# Altium project PCB_Project.PrjPcb
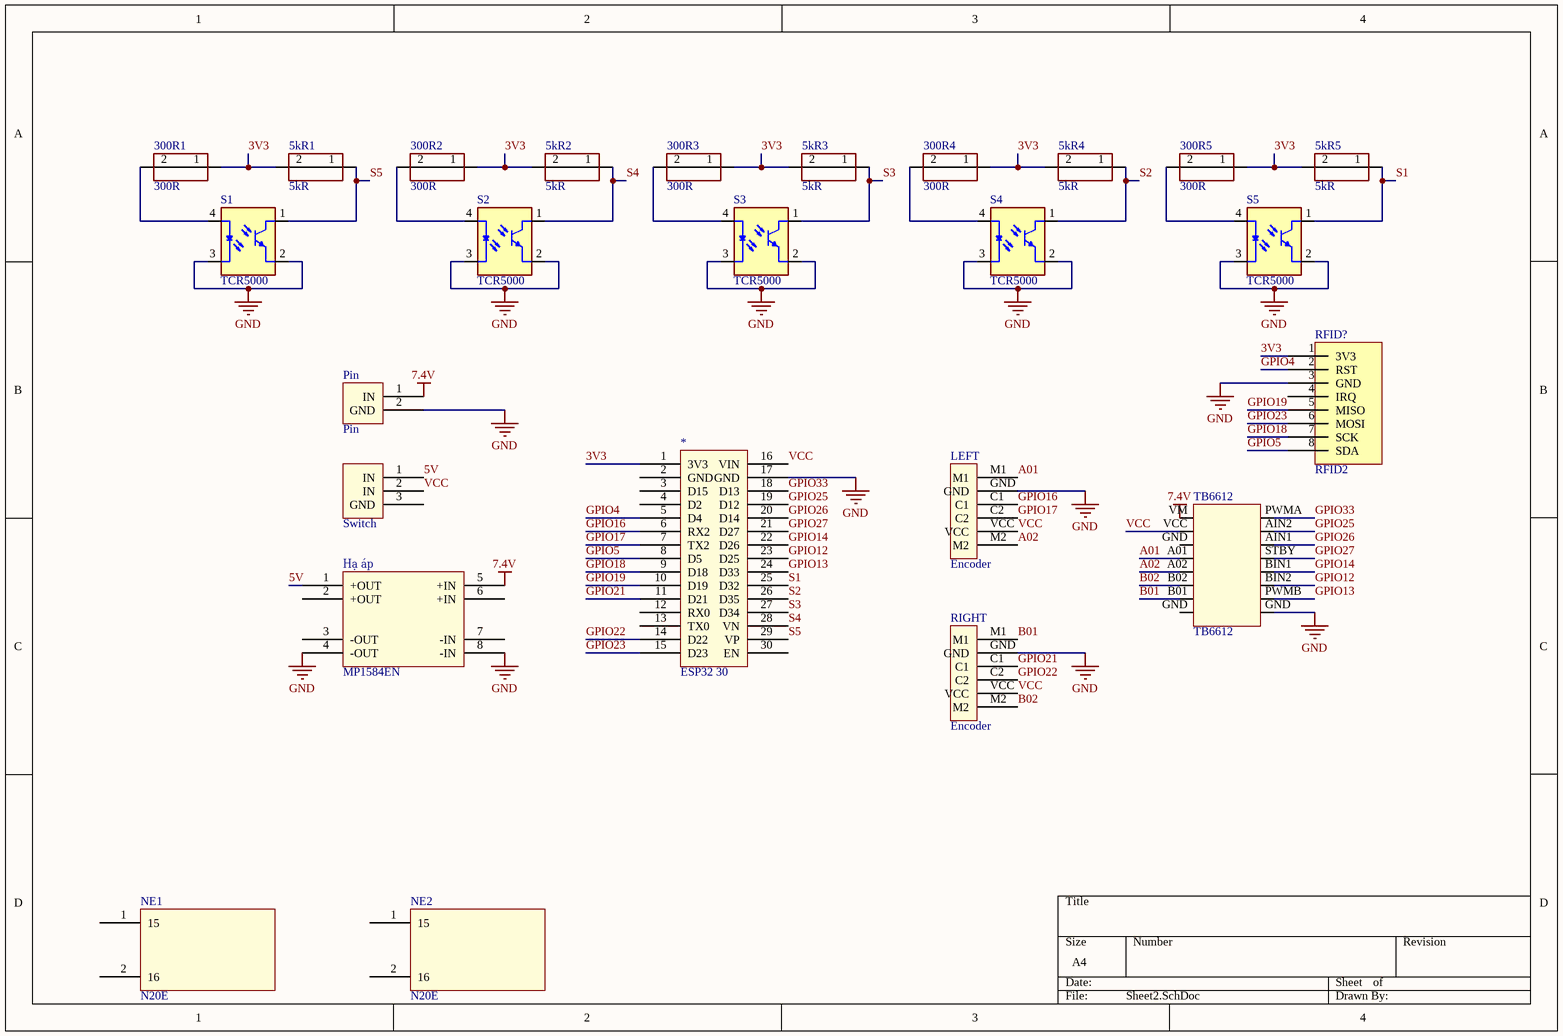
[diagram p0: Sheet2.SchDoc]
1 sheet, 25 parts. Net scope: global (net labels, ports and power ports of the same name join across sheets).
Board file: PCB3.PcbDoc

## Sheet Sheet2.SchDoc
size A4; SheetNumber: 1; SheetTotal: 1

### Parts
5kR1  5kR  [CMD]
5kR2  5kR  [CMD]
5kR3  5kR  [CMD]
5kR4  5kR  [CMD]
5kR5  5kR  [CMD]
300R1  300R  [CMD]
300R2  300R  [CMD]
300R3  300R  [CMD]
300R4  300R  [CMD]
300R5  300R  [CMD]
*  ESP32 30  [ESP32 30]
?  Switch  [Switch]
Hạ_áp  MP1584EN  [MP1584EN]
LEFT  Encoder  [Encoder]
NE1  N20E  [N20E]
NE2  N20E  [N20E]
Pin  Pin  [Pin]
RFID?  RFID2  [header_femalex8]
RIGHT  Encoder  [Encoder]
S1  TCR5000  [TCR5000]
S2  TCR5000  [TCR5000]
S3  TCR5000  [TCR5000]
S4  TCR5000  [TCR5000]
S5  TCR5000  [TCR5000]
TB6612  TB6612  [TB6612]

### Nets
7.4V: Hạ_áp.5(+IN) Pin.1(IN) TB6612.VM
GND: *.17(GND) Hạ_áp.4(-OUT) Hạ_áp.8(-IN) LEFT.GND Pin.2(GND) RFID?.3(GND) RIGHT.GND S1.2(E) S1.3(C) S2.2(E) S2.3(C) S3.2(E) S3.3(C) S4.2(E) S4.3(C) S5.2(E) S5.3(C) TB6612.GND
3V3: 5kR1.2 5kR2.2 5kR3.2 5kR4.2 5kR5.2 300R1.1 300R2.1 300R3.1 300R4.1 300R5.1 *.1(3V3) RFID?.1(3V3)
5V: ?.1(IN) Hạ_áp.1(+OUT)
A01: LEFT.M1 TB6612.A01
A02: LEFT.M2 TB6612.A02
B01: RIGHT.M1 TB6612.B01
B02: RIGHT.M2 TB6612.B02
GPIO4: *.5(D4) RFID?.2(RST)
GPIO5: *.8(D5) RFID?.8(SDA)
GPIO12: *.23(D25) TB6612.BIN2
GPIO13: *.24(D33) TB6612.PWMB
GPIO14: *.22(D26) TB6612.BIN1
GPIO16: *.6(RX2) LEFT.C1
GPIO17: *.7(TX2) LEFT.C2
GPIO18: *.9(D18) RFID?.7(SCK)
GPIO19: *.10(D19) RFID?.5(MISO)
GPIO21: *.11(D21) RIGHT.C1
GPIO22: *.14(D22) RIGHT.C2
GPIO23: *.15(D23) RFID?.6(MOSI)
GPIO25: *.19(D12) TB6612.AIN2
GPIO26: *.20(D14) TB6612.AIN1
GPIO27: *.21(D27) TB6612.STBY
GPIO33: *.18(D13) TB6612.PWMA
S1: 5kR5.1 *.25(D32) S5.1(CO)
S2: 5kR4.1 *.26(D35) S4.1(CO)
S3: 5kR3.1 *.27(D34) S3.1(CO)
S4: 5kR2.1 *.28(VN) S2.1(CO)
S5: 5kR1.1 *.29(VP) S1.1(CO)
VCC: *.16(VIN) ?.2(IN) LEFT.VCC RIGHT.VCC TB6612.VCC
Net300R1_2: 300R1.2 S1.4(A)
Net300R2_2: 300R2.2 S2.4(A)
Net300R3_2: 300R3.2 S3.4(A)
Net300R4_2: 300R4.2 S4.4(A)
Net300R5_2: 300R5.2 S5.4(A)

Not connected (* = marked no-connect by the designer): * 2(GND) 3(D15) 4(D2) 12(RX0) 13(TX0) 30(EN); ? 3(GND); Hạ_áp 2(+OUT) 3(-OUT) 6(+IN) 7(-IN); NE1 1(15) 2(16); NE2 1(15) 2(16); RFID? 4(IRQ)

### Library data of the parts
5kR1-5kR5 = 47kR
300R1-300R5 = 47R